# Altium schematic sheet CC3351.SchDoc
size A3; SheetNumber: 8; SheetTotal: 10
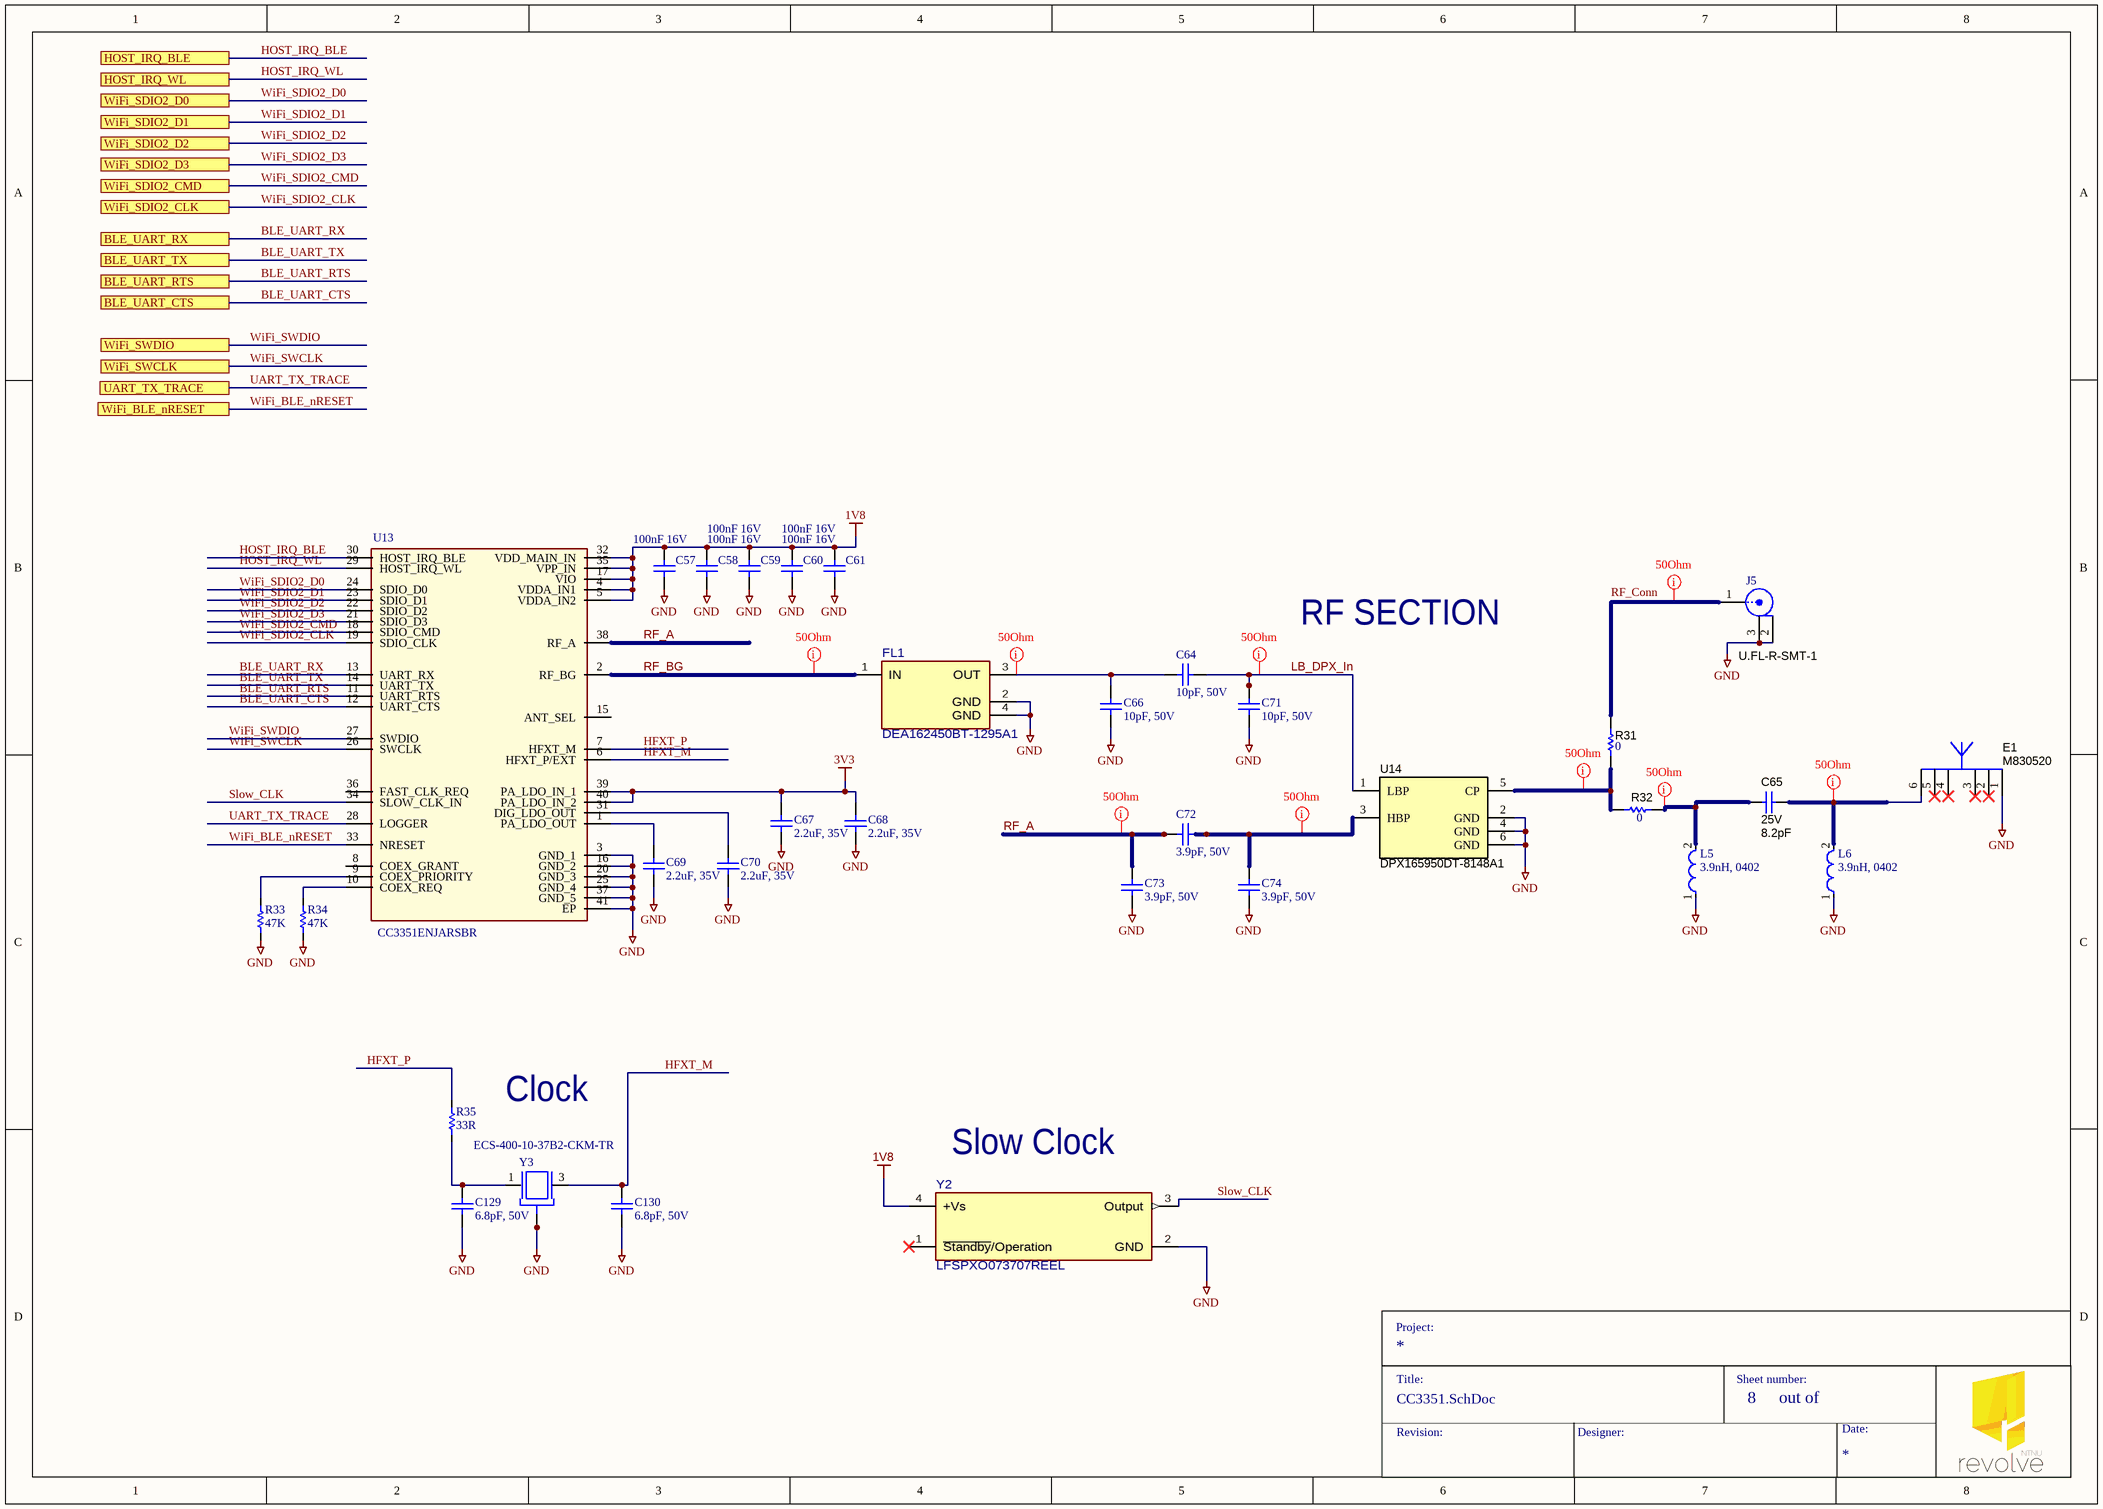
[diagram p0: CC3351.SchDoc]

## Parts
C57  100nF 16V  [0402]
C58  100nF 16V  [0402]
C59  100nF 16V  [0402]
C60  100nF 16V  [0402]
C61  100nF 16V  [0402]
C64  10pF, 50V  [0402 resistor]
C65  VDC_V: 25V  ValueDisplayed: 8.2pF  [0201]  (hidden comment: GJM0335C1E100JB01D)
C66  10pF, 50V  [0402 resistor]
C67  2.2uF, 35V  [0402 resistor]
C68  2.2uF, 35V  [0402 resistor]
C69  2.2uF, 35V  [0402 resistor]
C70  2.2uF, 35V  [0402 resistor]
C71  10pF, 50V  [0402 resistor]
C72  3.9pF, 50V  [0402 resistor]
C73  3.9pF, 50V  [0402 resistor]
C74  3.9pF, 50V  [0402 resistor]
C129  6.8pF, 50V  [0402 resistor]
C130  6.8pF, 50V  [0402 resistor]
E1  M830520  [Ethertronics_M830520]
FL1  DEA162450BT-1295A1  [FP-DEA162450BT-1295A1_SMT_FILTER_1MM60_0MM80-MFG]
J5  U.FL-R-SMT-1  [CONN_UFL-R-SMT-1]
L5  3.9nH, 0402  [INDC1005X55N]
L6  3.9nH, 0402  [INDC1005X55N]
R31  ValueDisplayed: 0  [0201]  (hidden comment: CRCW02010000Z0ED)
R32  ValueDisplayed: 0  [0201]  (hidden comment: CRCW02010000Z0ED)
R33  47K  [0603 Resistor]
R34  47K  [0603 Resistor]
R35  33R  [0603 Resistor]
U13  CC3351ENJARSBR  [RSB0040B-MFG]
U14  PartNumber: DPX165950DT-8148A1  [TDK_DPX165950DT-8148A1]  (hidden comment: CMP-0002040-1)
Y2  LFSPXO073707REEL  [FP-LFSPXO073707REEL_SMT4_2MM0_1MM6-MFG]
Y3  ECS-400-10-37B2-CKM-TR  [XTAL_ECS-400-10-37B2-CKM-TR]

## Ports
BLE_UART_CTS, BLE_UART_RTS, BLE_UART_RX, BLE_UART_TX, HOST_IRQ_BLE, HOST_IRQ_WL, UART_TX_TRACE, WiFi_BLE_nRESET, WiFi_SDIO2_CLK, WiFi_SDIO2_CMD, WiFi_SDIO2_D0, WiFi_SDIO2_D1, WiFi_SDIO2_D2, WiFi_SDIO2_D3, WiFi_SWCLK, WiFi_SWDIO

## Nets
1V8: C57.2 C58.2 C59.2 C60.2 C61.2 U13.4(VDDA_IN1) U13.5(VDDA_IN2) U13.17(VIO) U13.32(VDD_MAIN_IN) U13.35(VPP_IN) Y2.4(+Vs)
3V3: C67.2 C68.2 U13.39(PA_LDO_IN_1) U13.40(PA_LDO_IN_2)
GND: C57.1 C58.1 C59.1 C60.1 C61.1 C66.1 C67.1 C68.1 C69.1 C70.1 C71.1 C73.1 C74.1 C129.1 C130.1 E1.1(Feed) FL1.2(GND) FL1.4(GND) J5.2 J5.3 L5.1 L6.1 R33.2 R34.2 U13.3(GND_1) U13.16(GND_2) U13.20(GND_3) U13.25(GND_4) U13.37(GND_5) U13.41(EP) U14.2(GND) U14.4(GND) U14.6(GND) Y2.2(GND) Y3.2(GND) Y3.4(GND)
BLE_UART_CTS: U13.12(UART_CTS) ; port BLE_UART_CTS
BLE_UART_RTS: U13.11(UART_RTS) ; port BLE_UART_RTS
BLE_UART_RX: U13.13(UART_RX) ; port BLE_UART_RX
BLE_UART_TX: U13.14(UART_TX) ; port BLE_UART_TX
HFXT_M: C130.2 U13.6(HFXT_P/EXT) Y3.3(OUT/IN)
HFXT_P: R35.2 U13.7(HFXT_M)
HOST_IRQ_BLE: U13.30(HOST_IRQ_BLE) ; port HOST_IRQ_BLE
HOST_IRQ_WL: U13.29(HOST_IRQ_WL) ; port HOST_IRQ_WL
LB_DPX_In: C64.2 C71.2 U14.1(LBP)
RF_A: C72.2 C73.2 U13.38(RF_A)
RF_BG: FL1.1(IN) U13.2(RF_BG)
Slow_CLK: U13.34(SLOW_CLK_IN) Y2.3(Output)
UART_TX_TRACE: U13.28(LOGGER) ; port UART_TX_TRACE
WiFi_BLE_nRESET: U13.33(NRESET) ; port WiFi_BLE_nRESET
WiFi_SDIO2_CLK: U13.19(SDIO_CLK) ; port WiFi_SDIO2_CLK
WiFi_SDIO2_CMD: U13.18(SDIO_CMD) ; port WiFi_SDIO2_CMD
WiFi_SDIO2_D0: U13.24(SDIO_D0) ; port WiFi_SDIO2_D0
WiFi_SDIO2_D1: U13.23(SDIO_D1) ; port WiFi_SDIO2_D1
WiFi_SDIO2_D2: U13.22(SDIO_D2) ; port WiFi_SDIO2_D2
WiFi_SDIO2_D3: U13.21(SDIO_D3) ; port WiFi_SDIO2_D3
WiFi_SWCLK: U13.26(SWCLK) ; port WiFi_SWCLK
WiFi_SWDIO: U13.27(SWDIO) ; port WiFi_SWDIO
NetC64_1: C64.1 C66.2 FL1.3(OUT)
NetC65_1: C65.1 E1.6 L6.2
NetC65_2: C65.2 L5.2 R32.2
NetC69_2: C69.2 U13.1(PA_LDO_OUT)
NetC70_2: C70.2 U13.31(DIG_LDO_OUT)
NetC72_1: C72.1 C74.2 U14.3(HBP)
NetC129_2: C129.2 R35.1 Y3.1(IN/OUT)
NetJ5_1: J5.1 R31.2
NetR31_1: R31.1 R32.1 U14.5(CP)
NetR33_1: R33.1 U13.9(COEX_PRIORITY)
NetR34_1: R34.1 U13.10(COEX_REQ)

Not connected (* = marked no-connect by the designer): E1 2(GND)* 3(GND)* 4(Feed)* 5*; U13 8(COEX_GRANT) 15(ANT_SEL) 36(FAST_CLK_REQ); Y2 1(~{Standby}/Operation)*

## Layout directives
rule Undefined; net class RF: LB_DPX_In, NetC64_1, NetC65_1, NetC65_2, NetC72_1, NetJ5_1, NetR31_1, RF_A
rule Undefined: RF_BG

## Notes on the sheet
- RF SECTION
- Clock
- (near Y2) Slow Clock
- Labels drawn without touching a wire or pin: RF_Conn
- Project:
- Title:
- Sheet number:
- Revision:
- Designer:
- out of
- Date:

## Library data of the parts
C57-C61 = CMP-00017-A.2
C64 C66 C71 = CMP-00396-1: 10pF, 50V, 10%, 0402; Value: 10pF; Voltage Rating (DC): 50V
C65 = CMP-0064968-1: CAP, CERM, 8.2 pF, 25 V,+/- 1.2%, C0G/NP0, 0201; Manufacturer: MuRata; PartNumber: GRM0335C1E8R2BA01D; TaMin_C: -55°C; Polarized: N; SizeAreaWB_mm2: 2.08; Value1: Unknown; U/M: EA; Value: 8.2pF; TaMax_C: 125°C; SizeZ_mm: 0.26; SizeX_mm: 0.6; SizeY_mm: 0.3; SizeArea_mm2: 0.18; AEC Category: Q200; ComponentLink1URL: http://search.murata.co.jp/Ceramy/image/img/A01X/G101/ENG/GRM0335C1E8R2BA01-01.pdf; Supplier Part Number 2: 81-GRM0335C1E8R2BA1D; Publisher: Texas Instruments; Supplier 2: Mouser; TempCo: C0G/NP0; Published: 2008-06-19; RoHS: Y; MountType: SMT; Supplier 1: Digi-Key; PackageReference: 0201; Tolerance_%: 1.2%; Cap_Case: 0201; Value2: 25V; CompType: Capacitor; LatestRevisionDate: 2017-06-05; AEC Qualified: N; Cap_F: 8.2pF; ComponentLink1Description: Datasheet link; AEC Grade: N/A; Supplier Part Number 1: GRM0335C1E8R2BA01D; Technology: Ceramic
C67-C70 = CMP-001-P41-1: 2.2uF, 35V, 10%, 0402
C72-C74 = CMP-00395-1: 3.9pF, 50V, 10%, 0402; Voltage Rating (DC): 50V
C129 C130 = CMP-00397-1: 6.8pF, 50V, 10%, 0402; Voltage Rating (DC): 50V; Value: 6.8pF
E1 = CMP-0001857-1: WLAN ANTENNA 802.11, SMD; Manufacturer: Ethertronics; Alternate Manufacturer: ----; SizeAreaWB_mm2: 50; SizeArea_mm2: 24; SizeX_mm: 3; SizeY_mm: 8; SizeZ_mm: 1.33; PartNumber: M830520; CompType: Antenna; MountType: SMT; ComponentLink1Description: Datasheet URL; ComponentLink1URL: http://www.ethertronics.com/files/6014/0708/4228/Savvi_WLAN__8x3_M830510.pdf; RoHS: Y; PackageReference: 8x3mm; Publisher: Texas Instruments; LatestRevisionDate: 09/03/2017; Alternate PartNumber: ----
FL1 = CMP-0091509-1: 2.45GHz Center Frequency Band Pass RF Filter (Radio Frequency) 100MHz Bandwidth 1.8dB 0603 (1608 Metric), 3 PC Pad; Manufacturer: TDK; Bandwidth: 2400-2500MHz; AEC Qualified: No; Insertion Loss: 1.95dB; SizeZ_mm: 0.7mm; RoHS: TRUE; Operating Temperature Range: -40°C to +85°C; datasheet: https://product.tdk.com/info/en/documents/data_sheet/rf_bpf_dea162450bt-1295a1_en.pdf; PackageReference: SMT_FILTER_1MM60_0MM80; Frequency_Fixed: 2.45GHz; helpURL: https://upverter.com/upn/revision/67a1f53e71daea06/; ComponentLink1Description: Datasheet; Mouser Part Number: 810-DEA162450BT1295A; Part Number: DEA162450BT-1295A1; Datasheet Path: datasheets/Filter-DEA162450BT-1295A1.pdf; Lead Free: Yes; PartNumber: DEA162450BT-1295A1; Filter Type: Band Pass; Mouser Description: RF Filter Band Pass 2450MHz 2400MHz to 2500MHz 1.95dB 50Ohm SMD 4Pin 0603 T/R; Digikey Description: RF FILTER BAND PASS 2.45GHZ 0603; ComponentLink1URL: https://product.tdk.com/info/en/documents/data_sheet/rf_bpf_dea162450bt-1295a1_en.pdf; Digikey Part Number: 445-175610-1-ND
J5 = CMP-0075320-1: Receptacle, Ultra Miniature Coaxial, Male Pin, 50 ohm, SMT; Manufacturer: Hirose Electric Co. Ltd.; PartNumber: U.FL-R-SMT-1(01); CNHeader: False; Gender: Female; ContactFinish: Gold; ComponentLink1URL: https://www.hirose.com/product/en/download_file/key_name/U.FL%2DR%2DSMT%2D1%2801%29/category/Drawing%20(2D)/doc_file_id/37625/?file_category_id=6&item_id=03310472201&is_series=; Supplier Part Number 2: 18K7517; Publisher: Texas Instruments; Supplier 2: Newark; Supplier Part Number 3: 798-U.FL-R-SMT01; Color: Beige; Supplier 3: Mouser; RoHS: Y; MountType: SMT; Supplier 1: Digi-Key; PackageReference: Ultra small CO-AX SMD; PinCount: 3; CompType: Receptacle; LatestRevisionDate: 2017-07-12; Orientation: Vertical; ComponentLink1Description: Datasheet URL; Supplier Part Number 1: H122041-ND; CT: False
L5 L6 = Inductor SMD 3.9nH: 3.9 nH Unshielded Multilayer Inductor 750 mA 140mOhm Max 0402 (1005 Metric); DC Resistance (DCR): 175mR; Max DC Current: 1.1A; Inductance Tolerance: 30%; Self Resonant Frequency: 20MHz; Inductance: 4.7uH; Test Frequency: 1MHz; Core Material: Ferrite; Case Code (Metric): 2016; Min Operating Temperature: -40°C; Width: 1.6mm; Depth: 1.6mm; Max Operating Temperature: 125°C; Length: 2mm; Case Code (Imperial): 0806; Case/Package: 0806; Tolerance: 30%; Military Standard: Not; Current Rating: 1.1A; Packaging: Tape and Reel; Package Quantity: 1; Shielding: Shielded; Lead Free: Lead Free; Termination: SMD/SMT; Height - Seated (Max): 0.039inch; REACH SVHC: No SVHC; Mount: Surface Mount; DC Current: 1.1A; Height: 0.9mm; Supplier 1: DigiKey; Supplier Part Number 1: 490-LQG15HS3N9B02DCT-ND
R31 R32 = CMP-0027008-4: RES, 0, 5%, 0.05 W, 0201; Manufacturer: Vishay-Dale; Power_W: 50mW; TempCo: ppm/C; Value_Code: 0000; Value: 0; EIA_Code: E24; SizeX_mm: 0.6; SizeY_mm: 0.3; SizeZ_mm: 0.26; Value2: 0.05W; SizeArea_mm2: 0.18; AEC Qualified: N; AEC Category: Q200; RoHS: E; Value1: 5%; MountType: SMT; Supplier 1: Newark; PackageReference: 0201; Tolerance_%: 5%; Res_ohm: 0; CompType: Resistor; PartNumber: CRCW02010000Z0ED; ComponentLink1Description: Datasheet link; AEC Grade: N/A; Supplier Part Number 1: 72M6743; Technology: Thick Film; ComponentLink1URL: http://www.vishay.com/docs/20052/crcw0201e3.pdf
R33 R34 = CMP-001-B87-6: 47K, 1%, 1/10W, 0603
R35 = CMP-001-C30-7: 33R, 1%, 1/10W, 0603; Manufacturer: Panasonic; Manufacturer Part Number: ERJ-3EKF33R0V; Temperature Coefficient: 100ppm/°C; Max Power Dissipation: 100mW; Voltage Rating: 75V; REACH SVHC: No SVHC; Resistance: 33R; Composition: Thick Film; Tolerance: 1%; Lead Free: Lead Free; Contact Plating: Tin; Package Quantity: 1; Number of Terminations: 2; Number of Pins: 2; Case Code (Metric): 1608; Width: 0.031inch; Min Operating Temperature: -55°C; Military Standard: Not; Termination: SMD/SMT; Radiation Hardening: No; Case Code (Imperial): 0603; Mount: Surface Mount; Depth: 0.8mm; Max Operating Temperature: 155°C; Voltage Rating (DC): 75V; Features: Automotive AEC-Q200; Power Rating: 100mW; Packaging: Tape and Reel; Supplier Part Number: P33.0HCT-ND; Length: 1.6mm; Supplier: Digi-Key; Height: 0.022inch; Case/Package: 0603
U13 = CC3351ENJARSBR: Wi-Fi 6 (802.11ax)  Bluetooth Low Energy 5.4 in CC33x1 devices  Companion IC to any processor or MCU host capable of running a TCP/IP stack  Integrated 2.4GHz and 5GHz PA for complete wireless solution with up to +20.5dBm output power.  Operating temperature: 40C to +105C  Application throughput up to 50Mbps; Manufacturer_Name: Texas Instruments; Geometry.Height: 0.8mm; Manufacturer_Part_Number: CC3351ENJARSBR; Mouser Part Number: 595-CC3351ENJARSBR; Mouser Price/Stock: https://www.mouser.co.uk/ProductDetail/Texas-Instruments/CC3351ENJARSBR?qs=iLKYxzqNS77FIPECga1PlQ%3D%3D; Arrow Part Number: CC3351ENJARSBR; Arrow Price/Stock: https://www.arrow.com/en/products/cc3351enjarsbr/texas-instruments?utm_currency=USD&region=nac; Datasheet Link: https://www.ti.com/lit/ds/symlink/cc3351.pdf?ts=1729762003874&ref_url=https%253A%252F%252Fwww.ti.com%252F
U14 = CMP-0002040-1: Multilayer Diplexer for 2.4GHz W-LAN & Bluetooth / 5GHz W-LAN; Manufacturer: TDK; Alternate Manufacturer: ----; SizeAreaWB_mm2: 4.68; SizeArea_mm2: 1.28; SizeX_mm: 0.8; SizeY_mm: 1.6; SizeZ_mm: 0.7; CompType: Diplexer; MountType: SMT; ComponentLink1Description: Datasheet URL; ComponentLink1URL: https://sps06.itg.ti.com/sites/KMS/crossdivteams/altium/docs/ComponentDatasheets/DPX165950DT-8148A1.pdf; RoHS: Y; PackageReference: 1.6x0.8mm; Publisher: Texas Instruments; LatestRevisionDate: 09/03/2017; Alternate PartNumber: ----; Supplier 1: Digi-Key; Supplier Part Number 1: 445-174759-1-ND; Supplier 2: Mouser; Supplier Part Number 2: 810-DPX16595DT8148A1
Y2 = CMP-0094366-1: 32.768 kHz XO (Standard) CMOS Oscillator 1.8V Enable/Disable 4-SMD, No Lead; Manufacturer: IQD Frequency Products; Frequency Stability: 100ppm; Max Supply Voltage: 1.89V; Load Capacitance: 15pF; Min Supply Voltage: 1.71V; Max Supply Current: 0.2mA; SizeZ_mm: 0.8mm; ComponentLink1URL: https://www.iqdfrequencyproducts.com/products/pn/LFSPXO073707Reel.pdf; Operating Temperature Range: -40°C to +125°C; AEC Qualified: No; helpURL: https://upverter.com/upn/revision/c85886b3b224eb15/; Lead Free: Yes; Series: IQXO-404; PackageReference: SMT4_2MM0_1MM6; Part Number: LFSPXO073707REEL; Datasheet Path: datasheets/Crys-LFSPXO073707REEL.pdf; ComponentLink1Description: Datasheet; datasheet: https://www.iqdfrequencyproducts.com/products/pn/LFSPXO073707Reel.pdf; Frequency_Fixed: 32.768kHz; Digikey Part Number: 1923-1619-1-ND; Supplier 1: Digikey; Digikey Description: XTAL OSC XO 32.7680KHZ CMOS SMD; Supplier Part Number 1: 1923-1619-1-ND; PartNumber: LFSPXO073707REEL; Supplier Part Number 2: 449-LFSPXO073707REEL; Mouser Part Number: 449-LFSPXO073707REEL; Supplier 2: Mouser; RoHS: TRUE
Y3 = ECS-400-10-37B2-CKM-TR: Crystal 40MHz ±10ppm (Tol) ±10ppm (Stability) 10pF FUND 40Ohm 4-Pin Mini-CSMD T/R; MF: ECS Inc.; SnapEDA_Link: https://www.snapeda.com/parts/ECS-400-10-37B2-CKM-TR/ECS+Inc./view-part/?ref=snap; Package: ECX-1637B-37B-4 ECS; Value: *; MP: ECS-400-10-37B2-CKM-TR; Check_prices: https://www.snapeda.com/parts/ECS-400-10-37B2-CKM-TR/ECS+Inc./view-part/?ref=eda